# EAGLE schematic ACRoBaT - led board (EAGLE 7.4.0)
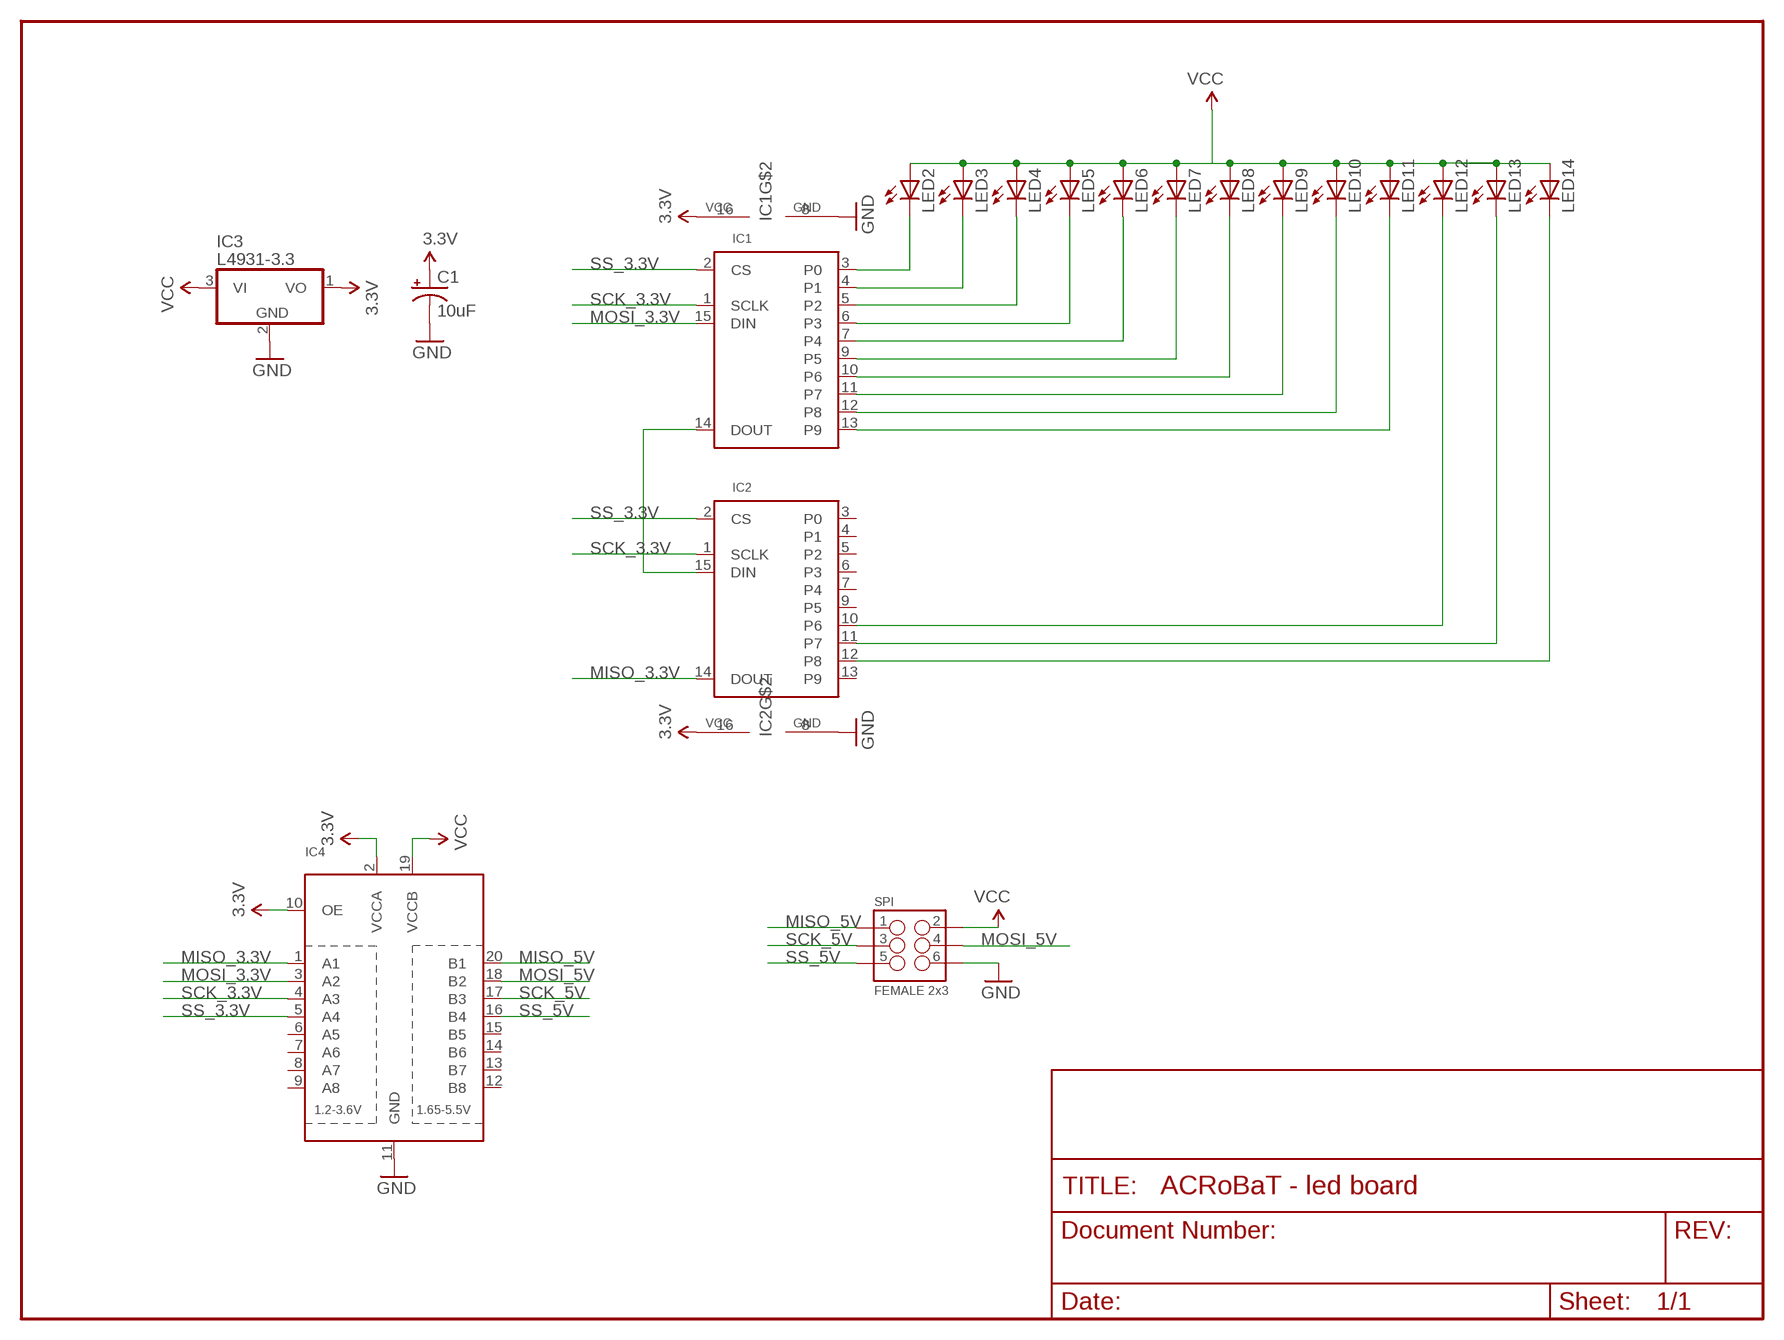
[diagram p0: schematic, sheet 1]

## Parts
C1  10uF  CAP_POLPTH2  [CPOL-RADIAL-10UF-25V]
IC1  MAX6966AEE  [QSOP16]
IC2  MAX6966AEE  [QSOP16]
IC3  L4931-3.3  78L05Z  [TO92]
IC4  TXB0108PWR  [TSSOP20]
LED2  LED5MM  [LED5MM]
LED3  LED5MM  [LED5MM]
LED4  LED5MM  [LED5MM]
LED5  LED5MM  [LED5MM]
LED6  LED5MM  [LED5MM]
LED7  LED5MM  [LED5MM]
LED8  LED5MM  [LED5MM]
LED9  LED5MM  [LED5MM]
LED10  LED5MM  [LED5MM]
LED11  LED5MM  [LED5MM]
LED12  LED5MM  [LED5MM]
LED13  LED5MM  [LED5MM]
LED14  LED5MM  [LED5MM]
SPI  FEMALE 2x3  M03X2FEMALE  [2X3]

## Nets
3.3V: C1.1(+) IC1.16(VCC) IC2.16(VCC) IC3.1(VO) IC4.2(VCCA) IC4.10(OE)
DOUT_3.3V: IC1.14(DOUT) IC2.15(DIN)
GND: C1.2(-) IC1.8(GND) IC2.8(GND) IC3.2(GND) IC4.11(GND) SPI.6
MISO_3.3V: IC2.14(DOUT) IC4.1(A1)
MISO_5V: IC4.20(B1) SPI.1
MOSI_3.3V: IC1.15(DIN) IC4.3(A2)
MOSI_5V: IC4.18(B2) SPI.4
N$4: IC1.3(P0) LED2.K(C)
N$17: IC1.4(P1) LED3.K(C)
N$18: IC1.5(P2) LED4.K(C)
N$19: IC1.6(P3) LED5.K(C)
N$20: IC1.7(P4) LED6.K(C)
N$22: IC1.9(P5) LED7.K(C)
N$23: IC1.10(P6) LED8.K(C)
N$24: IC1.11(P7) LED9.K(C)
N$25: IC1.12(P8) LED10.K(C)
N$26: IC1.13(P9) LED11.K(C)
N$27: IC2.10(P6) LED12.K(C)
N$28: IC2.11(P7) LED13.K(C)
N$29: IC2.12(P8) LED14.K(C)
SCK_3.3V: IC1.1(SCLK) IC2.1(SCLK) IC4.4(A3)
SCK_5V: IC4.17(B3) SPI.3
SS_3.3V: IC1.2(CS) IC2.2(CS) IC4.5(A4)
SS_5V: IC4.16(B4) SPI.5
VCC: IC3.3(VI) IC4.19(VCCB) LED2.A LED3.A LED4.A LED5.A LED6.A LED7.A LED8.A LED9.A LED10.A LED11.A LED12.A LED13.A LED14.A SPI.2
Unconnected: IC2.3(P0) IC2.4(P1) IC2.5(P2) IC2.6(P3) IC2.7(P4) IC2.9(P5) IC2.13(P9) IC4.6(A5) IC4.7(A6) IC4.8(A7) IC4.9(A8) IC4.12(B8) IC4.13(B7) IC4.14(B6) IC4.15(B5)

## Library data of the parts
C1 = SparkFun-Capacitors:CAP_POL: Capacitor Polarized These are standard SMD and PTH capacitors. Normally 10uF, 47uF, and 100uF in electrolytic and tantalum varieties. Always verify the external diameter of the through hole cap, it varies with capacity, voltage, and manufacturer. The EIA devices should be standard.
IC1 IC2 = max696x:MAX6966AEE
IC3 = adafruit:78*: Positive VOLTAGE REGULATOR Added bigger pads to the TO-92 package
IC4 = adafruit:TXB0108PWR: 8-Bit Bi-Directional Level Shifter 1.2V-3.6V (VCCA) to 1.65V-5.5V (VCCB) bi-directional level shifter with auto direction sensing. Max data rate - VCCA 1.8V: 20Mbps (50ns), VCCA 3.3V: 100Mbps (10ns) Digikey: 296-21527-1-ND
LED2-LED14 = led:LED: LED OSRAM: - CHIPLED LG R971, LG N971, LY N971, LG Q971, LY Q971, LO R971, LY R971 LH N974, LH R974 LS Q976, LO Q976, LY Q976 LO Q996 - Hyper CHIPLED LW Q18S LB Q993, LB Q99A, LB R99A - SideLED LS A670, LO A670, LY A670, LG A670, LP A670 LB A673, LV A673, LT A673, LW A673 LH A674 LY A675 LS A676, LA A676, LO A676, LY A676, LW A676 LS A679, LY A679, LG A679 - Hyper Micro SIDELED® LS Y876, LA Y876, LO Y876, LY Y876 LT Y87S - SmartLED LW L88C, LW L88S LB L89C, LB L89S, LG L890 LS L89K, LO L89K, LY L89K LS L896, LA L896, LO L896, LY L896 - TOPLED LS T670, LO T670, LY T670, LG T670, LP T670 LSG T670, LSP T670, LSY T670, LOP T670, LYG T670 LG T671, LOG T671, LSG T671 LB T673, LV T673, LT T673, LW T673 LH T674 LS T676, LA T676, LO T676, LY T676, LB T676, LH T676, LSB T676, LW T676 LB T67C, LV T67C, LT T67C, LS T67K, LO T67K, LY T67K, LW E67C LS E67B, LA E67B, LO E67B, LY E67B, LB E67C, LV E67C, LT E67C LW T67C LS T679, LY T679, LG T679 LS T770, LO T770, LY T770, LG T770, LP T770 LB T773, LV T773, LT T773, LW T773 LH T774 LS E675, LA E675, LY E675, LS T675 LS T776, LA T776, LO T776, LY T776, LB T776 LHGB T686 LT T68C, LB T68C - Hyper Mini TOPLED® LB M676 - Mini TOPLED Santana® LG M470 LS M47K, LO M47K, LY M47K Source: http://www.osram.convergy.de LUXEON: - LUMILED® LXK2-PW12-R00, LXK2-PW12-S00, LXK2-PW14-U00, LXK2-PW14-V00 LXK2-PM12-R00, LXK2-PM12-S00, LXK2-PM14-U00 LXK2-PE12-Q00, LXK2-PE12-R00, LXK2-PE12-S00, LXK2-PE14-T00, LXK2-PE14-U00 LXK2-PB12-K00, LXK2-PB12-L00, LXK2-PB12-M00, LXK2-PB14-N00, LXK2-PB14-P00, LXK2-PB14-Q00 LXK2-PR12-L00, LXK2-PR12-M00, LXK2-PR14-Q00, LXK2-PR14-R00 LXK2-PD12-Q00, LXK2-PD12-R00, LXK2-PD12-S00 LXK2-PH12-R00, LXK2-PH12-S00 LXK2-PL12-P00, LXK2-PL12-Q00, LXK2-PL12-R00 Source: www.luxeon.com KINGBRIGHT: KA-3528ASYC Source: www.kingbright.com
SPI = SparkFun-Connectors:M03X2: 2x3 .1" header. Shrouded, with keying- CONN-10681 SMT- CONN-11415 Pogo pins- HW-11044; PROD_ID: CONN-11566